# EAGLE schematic Mote_RgbLedStripController (EAGLE 7.5.0)
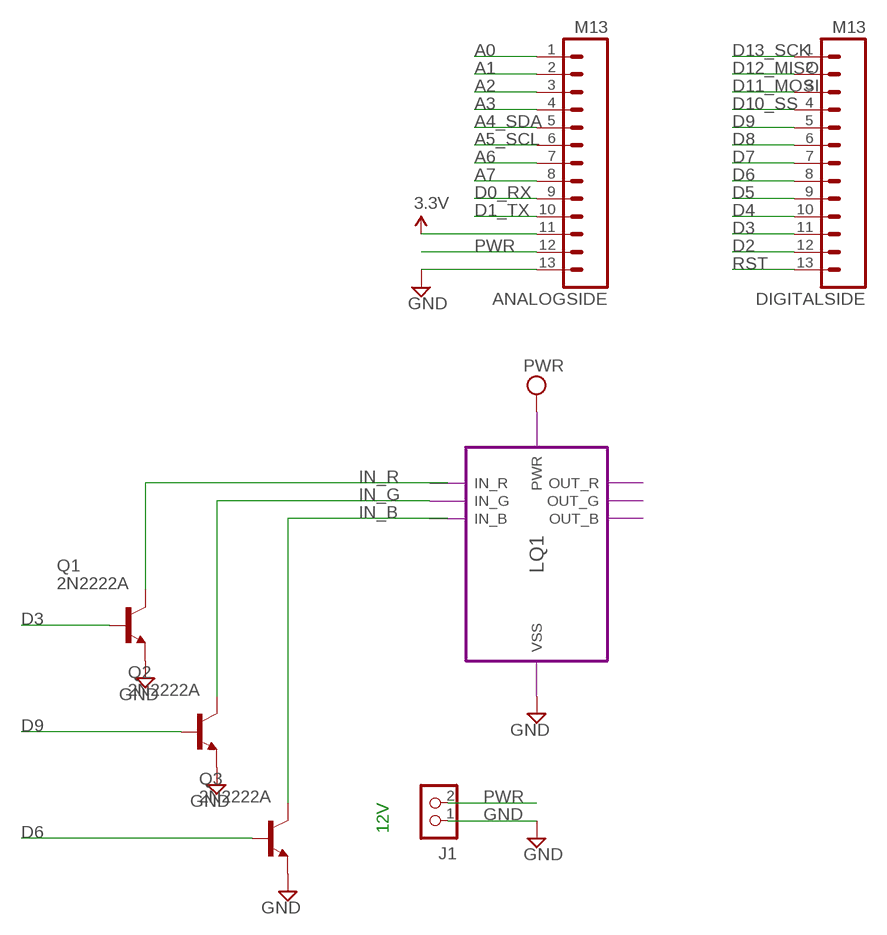
[diagram p0: schematic, sheet 1]

## Parts
ANALOGSIDE  M13  [1X13]
DIGITALSIDE  M13  [1X13]
J1  CON_TERMINAL_BLOCK_02-5MM  [TERMINAL_BLOCK_2P_5]
Q1  2N2222A  [TO18]
Q2  2N2222A  [TO18]
Q3  2N2222A  [TO18]

## Module instances
LQ1 = RGB_LED_AMPLIFIER

## Nets
A0: ANALOGSIDE.1
A1: ANALOGSIDE.2
A2: ANALOGSIDE.3
A3: ANALOGSIDE.4
A4_SDA: ANALOGSIDE.5
A5_SCL: ANALOGSIDE.6
A6: ANALOGSIDE.7
A7: ANALOGSIDE.8
D0_RX: ANALOGSIDE.9
D1_TX: ANALOGSIDE.10
D2: DIGITALSIDE.12
D3: DIGITALSIDE.11 Q1.2(B)
D4: DIGITALSIDE.10
D5: DIGITALSIDE.9
D6: DIGITALSIDE.8 Q3.2(B)
D7: DIGITALSIDE.7
D8: DIGITALSIDE.6
D9: DIGITALSIDE.5 Q2.2(B)
D10_SS: DIGITALSIDE.4
D11_MOSI: DIGITALSIDE.3
D12_MISO: DIGITALSIDE.2
D13_SCK: DIGITALSIDE.1
GND [power]: ANALOGSIDE.13 J1.1 Q1.1(E) Q2.1(E) Q3.1(E) ; port LQ1.VSS
IN_B: Q3.3(C) ; port LQ1.IN_B
IN_G: Q2.3(C) ; port LQ1.IN_G
IN_R: Q1.3(C)
N$1: port LQ1.IN_R
PWR [power]: ANALOGSIDE.12 J1.2
RST: DIGITALSIDE.13
VCC: ANALOGSIDE.11 ; port LQ1.PWR ; supply symbol labelled 3.3V, PWR

## Notes on the sheet
- 12V

## Library data of the parts
ANALOGSIDE DIGITALSIDE = SparkFun-Connectors:M13: 13-pin single row .1" header
J1 = dp_devices:CON_TERMINAL_BLOCK_02: 2 poles wire to board terminal block
Q1-Q3 = transistor-npn:2N2222*: NPN Transistor

## Module RGB_LED_AMPLIFIER
Ports: OUT_R(io) OUT_G(io) OUT_B(io) IN_R(io) IN_B(io) PWR(io) VSS(io) IN_G(io)

### Library data of the parts

## Net classes
1 power: width 0.381 mm, clearance 0.254 mm